# Altium schematic sheet Charging.SchDoc
size A4
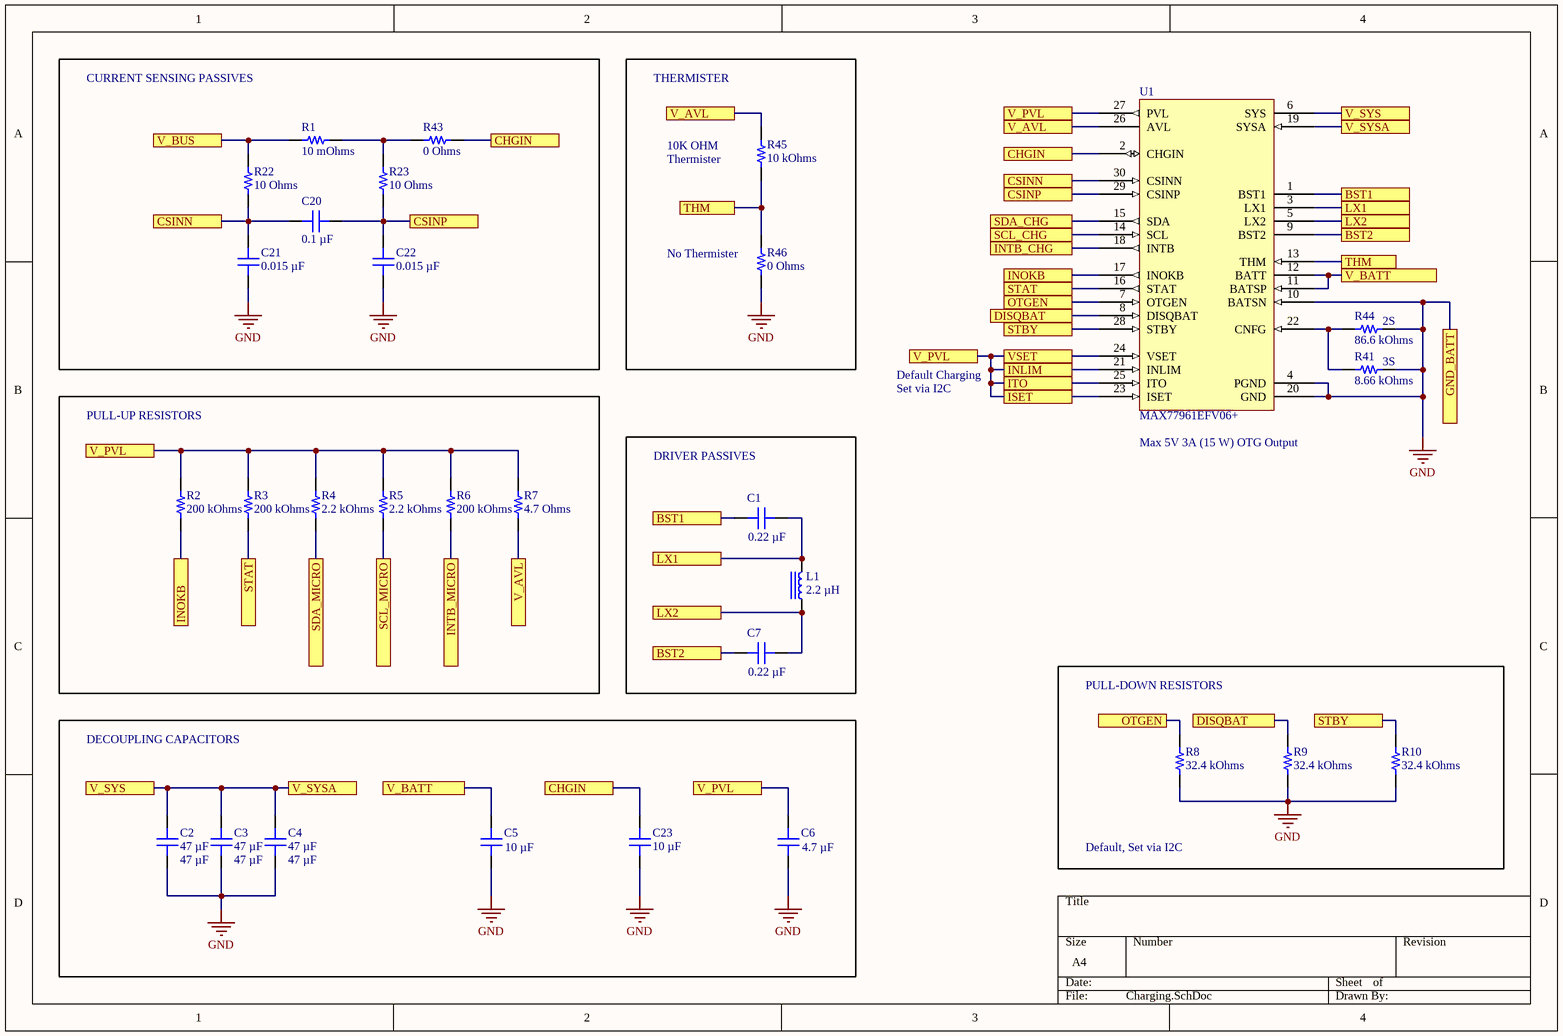
[diagram p0: Charging.SchDoc]

## Parts
C1  0.22 µF  [CAP 0402_1005]
C2  47 µF  [CAP 1206_3216 - 0.8MM]
C3  47 µF  [CAP 1206_3216 - 0.8MM]
C4  47 µF  [CAP 1206_3216 - 0.8MM]
C5  10 µF  [CAP 0603_1608]
C6  4.7 µF  [CAP 0402_1005]
C7  0.22 µF  [CAP 0402_1005]
C20  0.1 µF  [CAP 0402_1005]
C21  0.015 µF  [CAP 0402_1005]
C22  0.015 µF  [CAP 0402_1005]
C23  10 µF  [CAP 1206_3216 - 0.8MM]
L1  2.2 µH  [TAIYO YUDEN NRS8030]
R1  10 mOhms  [RES 2512_6432]
R2  200 kOhms  [RES 0402_1005]
R3  200 kOhms  [RES 0402_1005]
R4  2.2 kOhms  [RES 0402_1005]
R5  2.2 kOhms  [RES 0402_1005]
R6  200 kOhms  [RES 0402_1005]
R7  4.7 Ohms  [RES 0402_1005]
R8  32.4 kOhms  [RES 0402_1005]
R9  32.4 kOhms  [RES 0402_1005]
R10  32.4 kOhms  [RES 0402_1005]
R22  10 Ohms  [RES 0402_1005]
R23  10 Ohms  [RES 0402_1005]
R41  8.66 kOhms  [RES 0402_1005]  (no BOM)
R43  0 Ohms  [RES 1210_3225]
R44  86.6 kOhms  [RES 0402_1005]
R45  10 kOhms  [RES 0603_1608]
R46  0 Ohms  [RES 0603_1608]
U1  MAX77961EFV06+  [FC2QFN 30L]

## Blocks framed on the sheet
CURRENT SENSING PASSIVES: C20-C22 R1 R22 R23 R43
PULL-UP RESISTORS: R2-R7
DRIVER PASSIVES: C1 C7 L1
DECOUPLING CAPACITORS: C2-C6 C23

## Ports
BST1, BST2, CHGIN, CSINN, CSINP, DISQBAT, GND_BATT, INLIM, INOKB, INTB_CHG, INTB_MICRO, ISET, ITO, LX1, LX2, OTGEN, SCL_CHG, SCL_MICRO, SDA_CHG, SDA_MICRO, STAT, STBY, THM, V_AVL, V_BATT, V_BUS, V_PVL, V_SYS, V_SYSA, VSET

## Nets
GND: C2.1 C3.1 C4.1 C5.1 C6.1 C21.1 C22.1 C23.1 R8.1 R9.1 R10.1 R41.2 R44.2 R46.1 U1.4(PGND) U1.10(BATSN) U1.20(GND) ; port GND_BATT
BST1: C1.1 U1.1(BST1) ; port BST1
BST2: C7.1 U1.9(BST2) ; port BST2
CHGIN: C23.2 R43.2 U1.2(CHGIN) ; port CHGIN
CSINN: C20.1 C21.2 R22.1 U1.30(CSINN) ; port CSINN
CSINP: C20.2 C22.2 R23.1 U1.29(CSINP) ; port CSINP
DISQBAT: R9.2 U1.8(DISQBAT) ; port DISQBAT
INLIM: C6.2 R2.2 R3.2 R4.1 R5.1 R6.2 R7.2 U1.21(INLIM) U1.23(ISET) U1.24(VSET) U1.25(ITO) U1.27(PVL) ; port V_PVL, port VSET, port INLIM, port ITO, port ISET
INOKB: R2.1 U1.17(INOKB) ; port INOKB
INTB_CHG: U1.18(INTB) ; port INTB_CHG
INTB_MICRO: R6.1 ; port INTB_MICRO
LX1: C1.2 L1.2 U1.3(LX1) ; port LX1
LX2: C7.2 L1.1 U1.5(LX2) ; port LX2
OTGEN: R8.2 U1.7(OTGEN) ; port OTGEN
SCL_CHG: U1.14(SCL) ; port SCL_CHG
SCL_MICRO: R5.2 ; port SCL_MICRO
SDA_CHG: U1.15(SDA) ; port SDA_CHG
SDA_MICRO: R4.2 ; port SDA_MICRO
STAT: R3.1 U1.16(STAT) ; port STAT
STBY: R10.2 U1.28(STBY) ; port STBY
THM: R45.1 R46.2 U1.13(THM) ; port THM
V_AVL: R7.1 R45.2 U1.26(AVL) ; port V_AVL
V_BATT: C5.2 U1.11(BATSP) U1.12(BATT) ; port V_BATT
V_BUS: R1.1 R22.2 ; port V_BUS
V_SYS: C2.2 C3.2 C4.2 U1.6(SYS) U1.19(SYSA) ; port V_SYS, port V_SYSA
NetR1_2: R1.2 R23.2 R43.1
NetR41_1: R41.1 R44.1 U1.22(CNFG)

## Notes on the sheet
- THERMISTER
- (near R45) 10K OHM
- (near R45) Thermister
- (near R46) No Thermister
- Default Charging
- (near R44) 2S
- (near R41) 3S
- Set via I2C
- (near U1) Max 5V 3A (15 W) OTG Output
- PULL-DOWN RESISTORS
- Default, Set via I2C

## Library data of the parts
C1 C7 = JMK105B7224KV-F: CAP CER 0.22UF 6.3V X7R 0402; manufacturer: Taiyo Yuden; Tolerance: ±10%; Part Number: JMK105B7224KV-F; Value: 0.22 µF; Applications: SMPS Filtering; Capacitance: 0.22 µF; componentlink1description: Datasheet; componentlink1url: https://www.yuden.co.jp/productdata/catalog/mlcc01_e.pdf; componentlink2description: DigiKey Link; componentlink2url: https://www.digikey.com/en/products/detail/taiyo-yuden/JMK105B7224KV-F/2230260; Device Package: 0402 (1005 Metric); lastupdated: 9/08/2022 12:01:15 PM; Lifecycle Status: Active; Minimum Order: 1; Mounting Type: Surface Mount, MLCC; Operating Temperature: -55°C ~ 125°C; Package / Case: 0402 (1005 Metric); packaging: TapeAndReel; partid: 3263; Part Status: Active; price: 0.01; series: M; Size / Dimension: 0.039" L x 0.020" W (1.00mm x 0.50mm); Supplier 1: DigiKey; Supplier Part Number 1: 587-2475-1-ND; Temperature Coefficient: X7R; Thickness (Max): 0.022" (0.55mm); Voltage - Rated: 6.3V
C2-C4 = EMK316BBJ476ML-T: CAP CER 47UF 16V X5R 1206; manufacturer: Taiyo Yuden; Tolerance: ±20%; Part Number: EMK316BBJ476ML-T; Value: 47 µF; Applications: SMPS Filtering; Capacitance: 47 µF; componentlink1description: Datasheet; componentlink1url: https://ds.yuden.co.jp/TYCOMPAS/ut/detail?pn=EMK316BBJ476ML-T &u=M; componentlink2description: DigiKey Link; componentlink2url: https://www.digikey.com/en/products/detail/taiyo-yuden/EMK316BBJ476ML-T/7067010; Device Package: 1206 (3216 Metric); lastupdated: 9/08/2022 12:05:30 PM; Lifecycle Status: Active; Minimum Order: 1; Mounting Type: Surface Mount, MLCC; Operating Temperature: -55°C ~ 85°C; Package / Case: 1206 (3216 Metric); packaging: TapeAndReel; partid: 45139; Part Status: Active; price: 0.19; series: M; Size / Dimension: 0.126" L x 0.063" W (3.20mm x 1.60mm); Supplier 1: DigiKey; Supplier Part Number 1: 587-5425-1-ND; Temperature Coefficient: X5R; Thickness (Max): 0.075" (1.90mm); Voltage - Rated: 16V
C5 = GRT188R61C106ME13D: CAP CER 10UF 16V X5R 0603; manufacturer: Murata Electronics; Tolerance: ±20%; Part Number: GRT188R61C106ME13D; Value: 10 µF; Applications: Automotive; Capacitance: 10 µF; componentlink1description: Datasheet; componentlink1url: https://search.murata.co.jp/Ceramy/image/img/A01X/G101/ENG/GRT188R61C106ME13-01.pdf; componentlink2description: DigiKey Link; componentlink2url: https://www.digikey.com/en/products/detail/murata-electronics/GRT188R61C106ME13D/5416740; Device Package: 0603 (1608 Metric); lastupdated: 9/08/2022 12:02:59 PM; Lifecycle Status: Active; Minimum Order: 1; Mounting Type: Surface Mount, MLCC; Operating Temperature: -55°C ~ 85°C; Package / Case: 0603 (1608 Metric); packaging: TapeAndReel; partid: 2515; Part Status: Active; price: 0.07; Ratings: AEC-Q200; series: GRT; Size / Dimension: 0.063" L x 0.031" W (1.60mm x 0.80mm); Supplier 1: DigiKey; Supplier Part Number 1: 490-12318-1-ND; Temperature Coefficient: X5R; Thickness (Max): 0.035" (0.90mm); Voltage - Rated: 16V
C6 = GRM155R60J475ME47D: CAP CER 4.7UF 6.3V X5R 0402; manufacturer: Murata Electronics; Tolerance: ±20%; Part Number: GRM155R60J475ME47D; Value: 4.7 µF; Applications: General Purpose; Capacitance: 4.7 µF; componentlink1description: Datasheet; componentlink1url: https://www.murata.com/~/media/webrenewal/support/library/catalog/products/capacitor/mlcc/c02e.ashx?la=en-us; componentlink2description: DigiKey Link; componentlink2url: https://www.digikey.com/en/products/detail/murata-electronics/GRM155R60J475ME47D/3694656; Device Package: 0402 (1005 Metric); lastupdated: 9/08/2022 12:01:17 PM; Lifecycle Status: Active; Minimum Order: 1; Mounting Type: Surface Mount, MLCC; Operating Temperature: -55°C ~ 85°C; Package / Case: 0402 (1005 Metric); packaging: TapeAndReel; partid: 2084; Part Status: Active; price: 0.01; series: GRM; Size / Dimension: 0.039" L x 0.020" W (1.00mm x 0.50mm); Supplier 1: DigiKey; Supplier Part Number 1: 490-5915-1-ND; Temperature Coefficient: X5R; Thickness (Max): 0.024" (0.60mm); Voltage - Rated: 6.3V
C20 = CGA2B2X5R1A104M050BA: CAP CER 0.1UF 10V X5R 0402; manufacturer: TDK Corporation; Tolerance: ±20%; Part Number: CGA2B2X5R1A104M050BA; Value: 0.1 µF; Applications: Automotive; Capacitance: 0.1 µF; componentlink1description: Datasheet; componentlink1url: https://product.tdk.com/info/en/catalog/datasheets/mlcc_automotive_general_en.pdf?ref_disty=digikey; componentlink2description: DigiKey Link; componentlink2url: https://www.digikey.com/en/products/detail/tdk-corporation/CGA2B2X5R1A104M050BA/3949393; Device Package: 0402 (1005 Metric); lastupdated: 9/08/2022 12:01:16 PM; Lifecycle Status: Active; Minimum Order: 1; Mounting Type: Surface Mount, MLCC; Operating Temperature: -55°C ~ 85°C; Package / Case: 0402 (1005 Metric); packaging: TapeAndReel; partid: 2604; Part Status: Active; price: 0.01; Ratings: AEC-Q200; series: CGA; Size / Dimension: 0.039" L x 0.020" W (1.00mm x 0.50mm); Supplier 1: DigiKey; Supplier Part Number 1: 445-12157-1-ND; Temperature Coefficient: X5R; Thickness (Max): 0.022" (0.55mm); Voltage - Rated: 10V
C21 C22 = CGA2B3X7R1H153K050BB: CAP CER 0.015UF 50V X7R 0402; manufacturer: TDK Corporation; Tolerance: ±10%; Part Number: CGA2B3X7R1H153K050BB; Value: 0.015 µF; Applications: Automotive; Capacitance: 0.015 µF; componentlink1description: Datasheet; componentlink1url: https://product.tdk.com/info/en/catalog/datasheets/mlcc_automotive_general_en.pdf?ref_disty=digikey; componentlink2description: DigiKey Link; componentlink2url: https://www.digikey.com/en/products/detail/tdk-corporation/CGA2B3X7R1H153K050BB/2672787; Device Package: 0402 (1005 Metric); lastupdated: 9/08/2022 12:01:17 PM; Lifecycle Status: Active; Minimum Order: 1; Mounting Type: Surface Mount, MLCC; Operating Temperature: -55°C ~ 125°C; Package / Case: 0402 (1005 Metric); packaging: TapeAndReel; partid: 1927; Part Status: Active; price: 0.01; Ratings: AEC-Q200; series: CGA; Size / Dimension: 0.039" L x 0.020" W (1.00mm x 0.50mm); Supplier 1: DigiKey; Supplier Part Number 1: 445-6894-1-ND; Temperature Coefficient: X7R; Thickness (Max): 0.022" (0.55mm); Voltage - Rated: 50V
C23 = GMK316AB7106ML-TR: CAP CER 10UF 35V X7R 1206; manufacturer: Taiyo Yuden; Tolerance: ±20%; Part Number: GMK316AB7106ML-TR; Value: 10 µF; Applications: SMPS Filtering; Capacitance: 10 µF; componentlink1description: Datasheet; componentlink1url: http://www.yuden.co.jp/productdata/catalog/mlcc06_e.pdf; componentlink2description: DigiKey Link; componentlink2url: https://www.digikey.com/en/products/detail/taiyo-yuden/GMK316AB7106ML-TR/6563490; Device Package: 1206 (3216 Metric); lastupdated: 9/08/2022 12:05:27 PM; Lifecycle Status: Active; Minimum Order: 1; Mounting Type: Surface Mount, MLCC; Operating Temperature: -55°C ~ 125°C; Package / Case: 1206 (3216 Metric); packaging: TapeAndReel; partid: 22082; Part Status: Active; price: 0.15; series: M; Size / Dimension: 0.126" L x 0.063" W (3.20mm x 1.60mm); Supplier 1: DigiKey; Supplier Part Number 1: 587-4897-1-ND; Temperature Coefficient: X7R; Thickness (Max): 0.071" (1.80mm); Voltage - Rated: 35V
L1 = NRS8030T2R2NJGJV: FIXED IND 2.2UH 4.8A 19.5MOHM SM; Manufacturer: Taiyo Yuden; Current - Saturation: 4.9A; DC Resistance (DCR): 19.5mOhm Max; Frequency - Self Resonant: 60MHz; Inductance Frequency - Test: 100 kHz; Material - Core: Ferrite; Shielding: Shielded; Tolerance: ±30%; Type: Drum Core, Wirewound; Part Number: NRS8030T2R2NJGJV; ComponentLink1Description: Datasheet; ComponentLink1URL: https://ds.yuden.co.jp/TYCOMPAS/ut/detail?pn=NRS8030T2R2NJGJV  &u=M; ComponentLink2Description: DigiKey Link; ComponentLink2URL: https://www.digikey.com/en/products/detail/taiyo-yuden/NRS8030T2R2NJGJV/4693989; Current Rating (Amps): 4.8 A; Device Package: Nonstandard; Height - Seated (Max): 0.118" (3.00mm); Inductance: 2.2 µH; LastUpdated: 9/08/2022 12:55:01 PM; Lifecycle Status: Active; Minimum Order: 1; Mounting Type: Surface Mount; Operating Temperature: -40°C ~ 125°C; Package / Case: Nonstandard; Packaging: TapeAndReel; PartId: 5475; Part Status: Active; Price: 0.30; Ratings: AEC-Q200; Series: NR, S Type; Size / Dimension: 0.315" L x 0.315" W (8.00mm x 8.00mm); Supplier 1: DigiKey; Supplier Part Number 1: 587-3650-1-ND; Value: 2.2 µH
R1 = WSLP2512R0100FEA: RES 0.01 OHM 1% 3W 2512; Manufacturer: Vishay Dale; Temperature Coefficient: ±75ppm/°C; Part Number: WSLP2512R0100FEA; ComponentLink1Description: Datasheet; ComponentLink1URL: http://www.vishay.com/docs/30122/wslp.pdf; ComponentLink2Description: DigiKey Link; ComponentLink2URL: http://digikey.com/product-detail/en/vishay-dale/WSLP2512R0100FEA/541-10158-1-ND/9758595; Composition: Metal Element; Device Package: 2512 (6432 Metric); Features: Anti-Sulfur, Automotive AEC-Q200, Current Sense, Moisture Resistant, Pulse Withstanding; Height - Seated (Max): 0.035" (0.89mm); LastUpdated: 9/08/2022 12:50:26 PM; Lifecycle Status: Active; Minimum Order: 1; Number of Terminations: 2; Operating Temperature: -65°C ~ 170°C; Package / Case: 2512 (6432 Metric); Packaging: TapeAndReel; Part Status: Active; Power (Watts): 3W; Price: 0.44; Ratings: AEC-Q200; Resistance: 10 mOhms; Series: WSLP; Size / Dimension: 0.250" L x 0.125" W (6.35mm x 3.18mm); Supplier 1: DigiKey; Supplier Part Number 1: 541-10158-1-ND; Supplier Device Package: 2512; Tolerance: ±1%; Value: 10 mOhms
R2 R3 R6 = RP73PF1E200KBTD: RES 200K OHM 0.1% 1/10W 0402; Manufacturer: TE Connectivity Passive Product; Power (Watts): 0.1W, 1/10W; Temperature Coefficient: ±25ppm/°C; Part Number: RP73PF1E200KBTD; Value: 200 kOhms; ComponentLink1Description: Datasheet; ComponentLink1URL: https://www.te.com/commerce/DocumentDelivery/DDEController?Action=srchrtrv&DocNm=1773272&DocType=DS&DocLang=English; ComponentLink2Description: DigiKey Link; ComponentLink2URL: https://www.digikey.com/en/products/detail/te-connectivity-passive-product/RP73PF1E200KBTD/8261082; Composition: Thin Film; Device Package: 0402 (1005 Metric); Height - Seated (Max): 0.014" (0.35mm); LastUpdated: 9/08/2022 12:11:04 PM; Lifecycle Status: Active; Minimum Order: 1; Number of Terminations: 2; Operating Temperature: -55°C ~ 155°C; Package / Case: 0402 (1005 Metric); Packaging: TapeAndReel; PartId: 2427; Part Status: Active; Price: 0.09; Resistance: 200 kOhms; Series: RP73, Holsworthy; Size / Dimension: 0.039" L x 0.020" W (1.00mm x 0.50mm); Supplier 1: DigiKey; Supplier Part Number 1: A127540CT-ND; Supplier Device Package: 0402; Tolerance: ±0.1%
R4 R5 = TNPW04022K20BYEP: RES 2.2K OHM 0.1% 1/10W 0402; Manufacturer: Vishay Dale; Power (Watts): 0.1W, 1/10W; Temperature Coefficient: ±10ppm/°C; Part Number: TNPW04022K20BYEP; Value: 2.2 kOhms; ComponentLink1Description: Datasheet; ComponentLink1URL: http://www.vishay.com/docs/28758/tnpw_e3.pdf; ComponentLink2Description: DigiKey Link; ComponentLink2URL: https://www.digikey.com/en/products/detail/vishay-dale/TNPW04022K20BYEP/8636618; Composition: Thin Film; Device Package: 0402 (1005 Metric); Features: Anti-Sulfur, Automotive AEC-Q200, Moisture Resistant; Height - Seated (Max): 0.016" (0.40mm); LastUpdated: 9/08/2022 12:11:02 PM; Lifecycle Status: Active; Minimum Order: 1; Number of Terminations: 2; Operating Temperature: -55°C ~ 155°C; Package / Case: 0402 (1005 Metric); Packaging: TapeAndReel; PartId: 3077; Part Status: Active; Price: 0.28; Ratings: AEC-Q200; Resistance: 2.2 kOhms; Series: TNPW e3; Size / Dimension: 0.039" L x 0.020" W (1.00mm x 0.50mm); Supplier 1: DigiKey; Supplier Part Number 1: 541-9805-1-ND; Supplier Device Package: 0402; Tolerance: ±0.1%
R7 = CRCW04024R70JNED: RES SMD 4.7 OHM 5% 1/16W 0402; Manufacturer: Vishay Dale; Power (Watts): 0.063W, 1/16W; Temperature Coefficient: ±200ppm/°C; Part Number: CRCW04024R70JNED; Value: 4.7 Ohms; ComponentLink1Description: Datasheet; ComponentLink1URL: http://www.vishay.com/docs/20035/dcrcwe3.pdf; ComponentLink2Description: DigiKey Link; ComponentLink2URL: https://www.digikey.com/en/products/detail/vishay-dale/CRCW04024R70JNED/1177512; Composition: Thick Film; Device Package: 0402 (1005 Metric); Features: Automotive AEC-Q200; Height - Seated (Max): 0.016" (0.40mm); LastUpdated: 9/08/2022 12:10:57 PM; Lifecycle Status: Active; Minimum Order: 1; Number of Terminations: 2; Operating Temperature: -55°C ~ 155°C; Package / Case: 0402 (1005 Metric); Packaging: CutTape; PartId: 4704; Part Status: Active; Price: 0.01; Ratings: AEC-Q200; Resistance: 4.7 Ohms; Series: CRCW; Size / Dimension: 0.039" L x 0.020" W (1.00mm x 0.50mm); Supplier 1: DigiKey; Supplier Part Number 1: 541-4.7JCT-ND; Supplier Device Package: 0402; Tolerance: ±5%
R8-R10 = CPF0402B32K4E1: RES SMD 32.4KOHM 0.1% 1/16W 0402; Manufacturer: TE Connectivity Passive Product; Power (Watts): 0.063W, 1/16W; Temperature Coefficient: ±25ppm/°C; Part Number: CPF0402B32K4E1; Value: 32.4 kOhms; ComponentLink1Description: Datasheet; ComponentLink1URL: https://www.te.com/commerce/DocumentDelivery/DDEController?Action=srchrtrv&DocNm=1773200&DocType=DS&DocLang=English; ComponentLink2Description: DigiKey Link; ComponentLink2URL: https://www.digikey.com/en/products/detail/te-connectivity-passive-product/CPF0402B32K4E1/2382531; Composition: Thin Film; Device Package: 0402 (1005 Metric); Height - Seated (Max): 0.014" (0.35mm); LastUpdated: 9/08/2022 12:10:59 PM; Lifecycle Status: Active; Minimum Order: 1; Number of Terminations: 2; Operating Temperature: -55°C ~ 155°C; Package / Case: 0402 (1005 Metric); Packaging: TapeAndReel; PartId: 4116; Part Status: Active; Price: 0.15; Resistance: 32.4 kOhms; Series: CPF, Neohm; Size / Dimension: 0.039" L x 0.020" W (1.00mm x 0.50mm); Supplier 1: DigiKey; Supplier Part Number 1: A102795CT-ND; Supplier Device Package: 0402; Tolerance: ±0.1%
R22 R23 = AC0402FR-0710RL: RES SMD 10 OHM 1% 1/16W 0402; Manufacturer: Yageo; Power (Watts): 0.063W, 1/16W; Temperature Coefficient: ±200ppm/°C; Part Number: AC0402FR-0710RL; Value: 10 Ohms; ComponentLink1Description: Datasheet; ComponentLink1URL: https://www.yageo.com/upload/media/product/productsearch/datasheet/rchip/PYu-AC_51_RoHS_L_7.pdf; ComponentLink2Description: DigiKey Link; ComponentLink2URL: https://www.digikey.com/en/products/detail/yageo/AC0402FR-0710RL/5895033; Composition: Thick Film; Device Package: 0402 (1005 Metric); Features: Automotive AEC-Q200, Moisture Resistant; Height - Seated (Max): 0.015" (0.37mm); LastUpdated: 9/08/2022 12:11:01 PM; Lifecycle Status: Active; Minimum Order: 1; Number of Terminations: 2; Operating Temperature: -55°C ~ 155°C; Package / Case: 0402 (1005 Metric); Packaging: CutTape; PartId: 3438; Part Status: Active; Price: 0.01; Ratings: AEC-Q200; Resistance: 10 Ohms; Series: AC; Size / Dimension: 0.039" L x 0.020" W (1.00mm x 0.50mm); Supplier 1: DigiKey; Supplier Part Number 1: YAG3438CT-ND; Supplier Device Package: 0402; Tolerance: ±1%
R41 = RK73H1ETTP8661F: RES 8.66K OHM 1% 1/10W 0402; Manufacturer: KOA Speer Electronics, Inc.; Power (Watts): 0.1W, 1/10W; Temperature Coefficient: ±100ppm/°C; Part Number: RK73H1ETTP8661F; Value: 8.66 kOhms; ComponentLink1Description: Datasheet; ComponentLink1URL: http://www.koaspeer.com/catimages/Products/RK73H/RK73H.pdf; ComponentLink2Description: DigiKey Link; ComponentLink2URL: https://www.digikey.com/en/products/detail/koa-speer-electronics-inc/RK73H1ETTP8661F/9844354; Composition: Thick Film; Device Package: 0402 (1005 Metric); Features: Automotive AEC-Q200, Moisture Resistant; Height - Seated (Max): 0.016" (0.40mm); LastUpdated: 9/08/2022 12:10:55 PM; Lifecycle Status: Active; Minimum Order: 1; Number of Terminations: 2; Operating Temperature: -55°C ~ 155°C; Package / Case: 0402 (1005 Metric); Packaging: CutTape; PartId: 5433; Part Status: Active; Price: 0.01; Ratings: AEC-Q200; Resistance: 8.66 kOhms; Series: RK73H; Size / Dimension: 0.039" L x 0.020" W (1.00mm x 0.50mm); Supplier 1: DigiKey; Supplier Part Number 1: 2019-RK73H1ETTP8661FCT-ND; Supplier Device Package: 0402; Tolerance: ±1%
R43 = RC1210JR-070RL: RES 0 OHM JUMPER 1/2W 1210; Manufacturer: Yageo; Power (Watts): 0.5W, 1/2W; Part Number: RC1210JR-070RL; ComponentLink1Description: Datasheet; ComponentLink1URL: https://www.yageo.com/upload/media/product/productsearch/datasheet/rchip/PYu-RC_Group_51_RoHS_L_10.pdf; ComponentLink2Description: DigiKey Link; ComponentLink2URL: https://www.digikey.com/en/products/detail/yageo/RC1210JR-070RL/5919839; Composition: Thick Film; Device Package: 1210 (3225 Metric); Features: Moisture Resistant; Height - Seated (Max): 0.024" (0.60mm); LastUpdated: 9/08/2022 12:50:16 PM; Lifecycle Status: Active; Minimum Order: 1; Number of Terminations: 2; Operating Temperature: -55°C ~ 155°C; Package / Case: 1210 (3225 Metric); Packaging: TapeAndReel; Part Status: Active; Price: 0.01; Resistance: 0 Ohms; Series: RC_L; Size / Dimension: 0.122" L x 0.102" W (3.10mm x 2.60mm); Supplier 1: DigiKey; Supplier Part Number 1: YAG3375CT-ND; Supplier Device Package: 1210; Tolerance: Jumper; Value: 0 Ohms
R44 = RMCF0402FT86K6: RES 86.6K OHM 1% 1/16W 0402; Manufacturer: Stackpole Electronics Inc; Power (Watts): 0.063W, 1/16W; Temperature Coefficient: ±100ppm/°C; Part Number: RMCF0402FT86K6; Value: 86.6 kOhms; ComponentLink1Description: Datasheet; ComponentLink1URL: https://www.seielect.com/catalog/sei-rmcf_rmcp.pdf; ComponentLink2Description: DigiKey Link; ComponentLink2URL: https://www.digikey.com/en/products/detail/stackpole-electronics-inc/RMCF0402FT86K6/1761648; Composition: Thick Film; Device Package: 0402 (1005 Metric); Features: Automotive AEC-Q200; Height - Seated (Max): 0.016" (0.40mm); LastUpdated: 9/08/2022 12:10:51 PM; Lifecycle Status: Active; Minimum Order: 1; Number of Terminations: 2; Operating Temperature: -55°C ~ 155°C; Package / Case: 0402 (1005 Metric); Packaging: CutTape; PartId: 7192; Part Status: Active; Price: 0.01; Ratings: AEC-Q200; Resistance: 86.6 kOhms; Series: RMCF; Size / Dimension: 0.039" L x 0.020" W (1.00mm x 0.50mm); Supplier 1: DigiKey; Supplier Part Number 1: RMCF0402FT86K6CT-ND; Supplier Device Package: 0402; Tolerance: ±1%
R45 = RCS060310K0JNEA: RES SMD 10K OHM 5% 1/4W 0603; Manufacturer: Vishay Dale; Power (Watts): 0.25W, 1/4W; Temperature Coefficient: ±200ppm/°C; Part Number: RCS060310K0JNEA; Value: 10 kOhms; ComponentLink1Description: Datasheet; ComponentLink1URL: http://www.vishay.com/docs/20065/rcse3.pdf; ComponentLink2Description: DigiKey Link; ComponentLink2URL: https://www.digikey.com/en/products/detail/vishay-dale/RCS060310K0JNEA/5866963; Composition: Thick Film; Device Package: 0603 (1608 Metric); Features: Automotive AEC-Q200, Pulse Withstanding; Height - Seated (Max): 0.020" (0.50mm); LastUpdated: 14/08/2022 9:31:26 PM; Lifecycle Status: Active; Minimum Order: 1; Number of Terminations: 2; Operating Temperature: -55°C ~ 155°C; Package / Case: 0603 (1608 Metric); Packaging: TapeAndReel; PartId: 5383; Part Status: Active; Price: 0.01; Ratings: AEC-Q200; Resistance: 10 kOhms; Series: RCS e3; Size / Dimension: 0.061" L x 0.033" W (1.55mm x 0.85mm); Supplier 1: DigiKey; Supplier Part Number 1: 541-2817-1-ND; Supplier Device Package: 0603; Tolerance: ±5%
R46 = RCA06030000ZSEA: RES SMD 0 OHM JUMPER 1/10W 0603; Manufacturer: Vishay Dale; Power (Watts): 0.1W, 1/10W; Part Number: RCA06030000ZSEA; Value: 0 Ohms; ComponentLink1Description: Datasheet; ComponentLink1URL: http://www.vishay.com/docs/20037/rcae3.pdf; ComponentLink2Description: DigiKey Link; ComponentLink2URL: https://www.digikey.com/en/products/detail/vishay-dale/RCA06030000ZSEA/4946761; Composition: Thick Film; Device Package: 0603 (1608 Metric); Features: Anti-Sulfur, Automotive AEC-Q200; Height - Seated (Max): 0.020" (0.50mm); LastUpdated: 9/08/2022 12:17:56 PM; Lifecycle Status: Active; Minimum Order: 1; Number of Terminations: 2; Operating Temperature: -55°C ~ 155°C; Package / Case: 0603 (1608 Metric); Packaging: TapeAndReel; PartId: 5740; Part Status: Active; Price: 0.01; Ratings: AEC-Q200; Resistance: 0 Ohms; Series: RCA; Size / Dimension: 0.061" L x 0.033" W (1.55mm x 0.85mm); Supplier 1: DigiKey; Supplier Part Number 1: 541-2192-1-ND; Supplier Device Package: 0603; Tolerance: Jumper
U1 = MAX77961EFV06+: 25VIN 3A/6AOUT USB-C Buck-Boost Charger with Integrated FETs for 2S/3S Li-Ion Batteries - 4mm x 4mm, 30-Lead FC2QFN